# EAGLE board max10adc_v9.0_rack (EAGLE 9.6.2), part 1 of 2
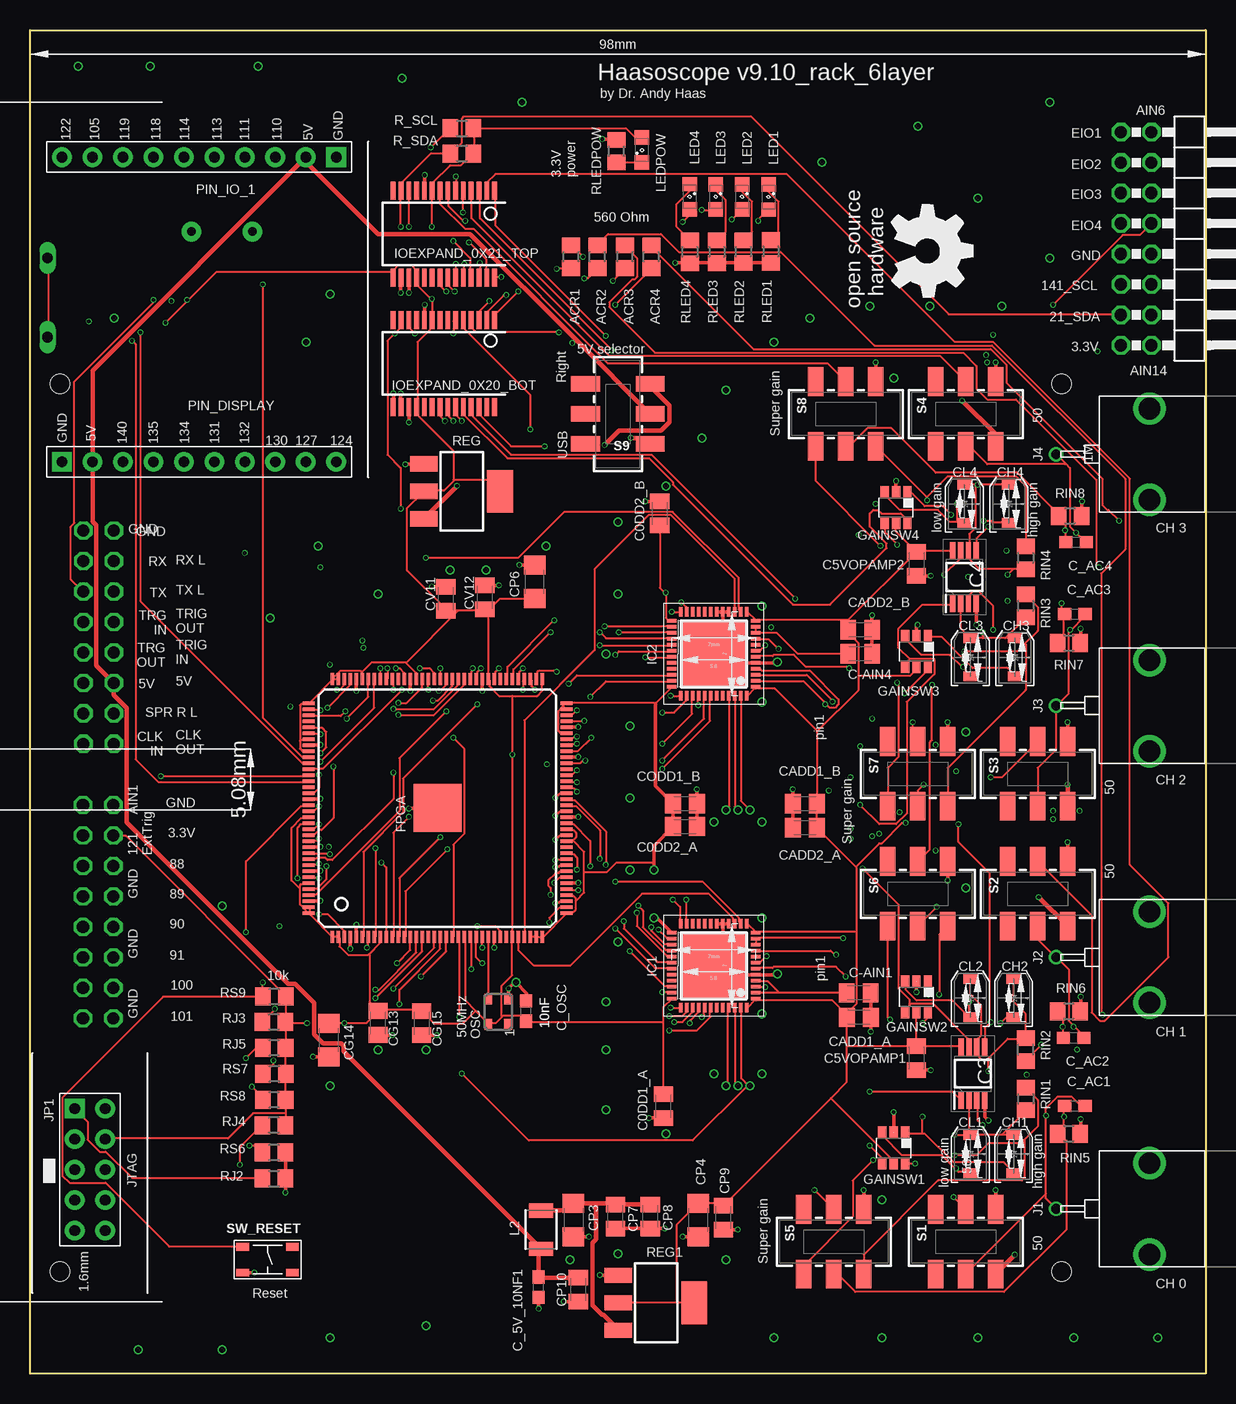
[diagram p3: board, top side]
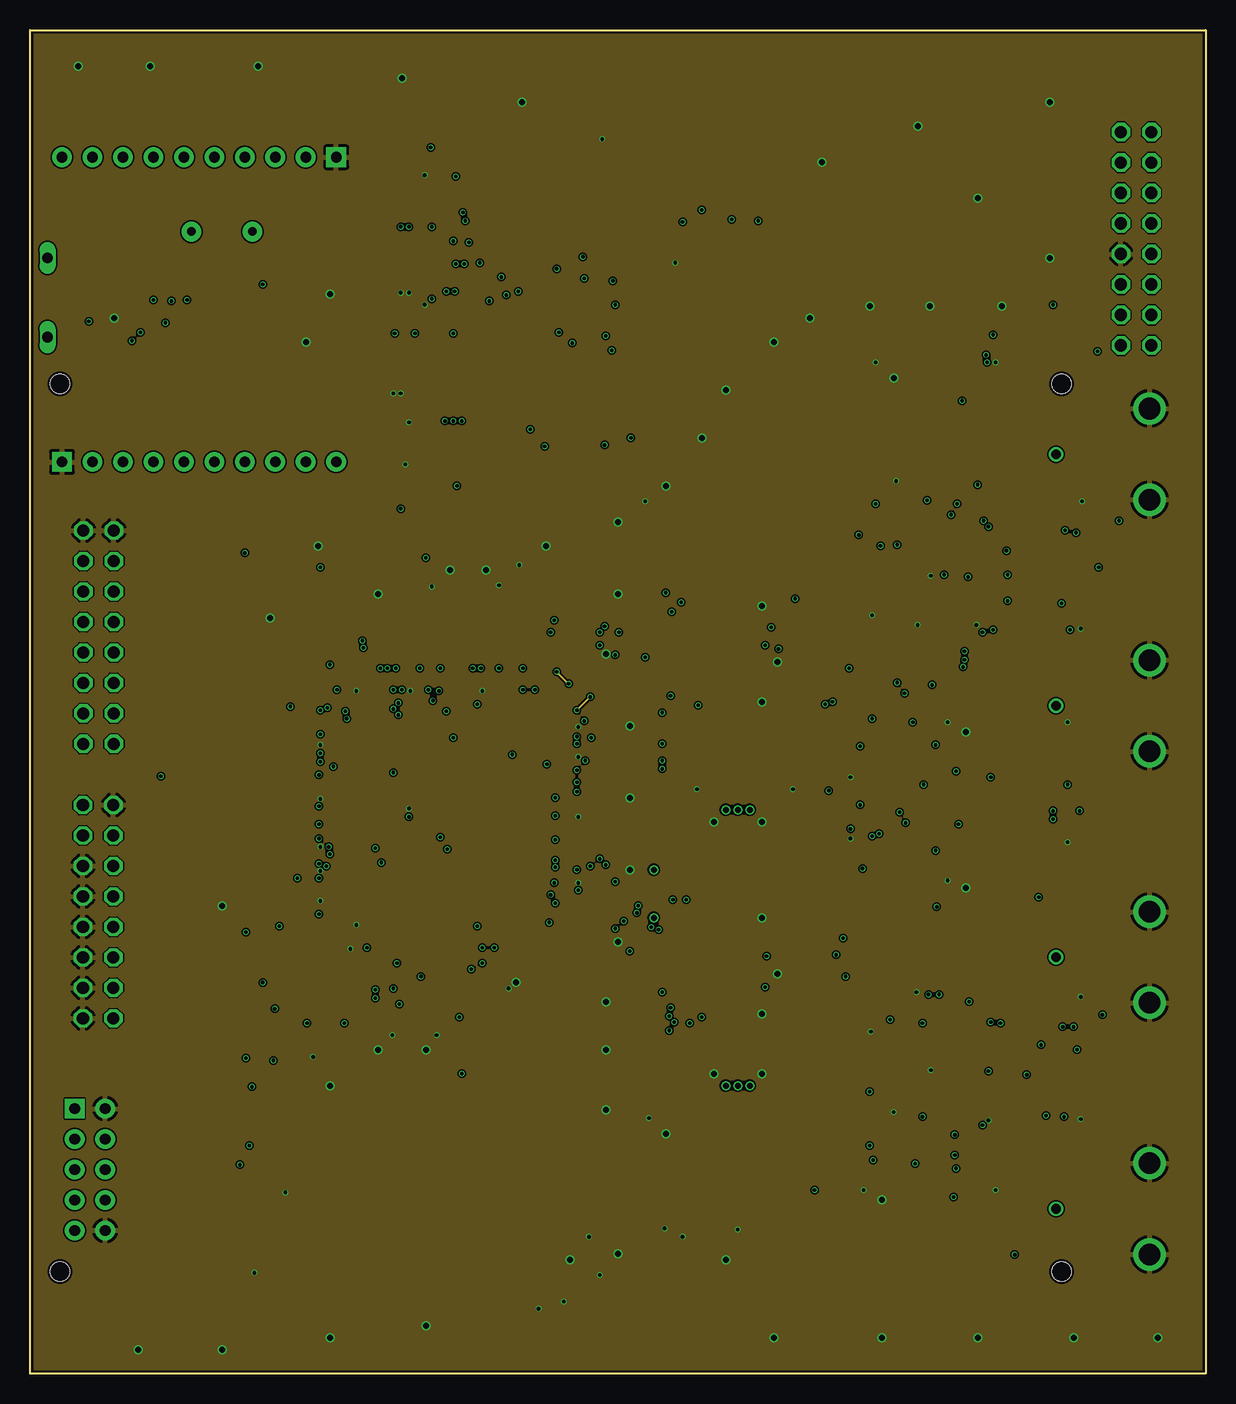
[diagram p4: board, inner layer Route2]
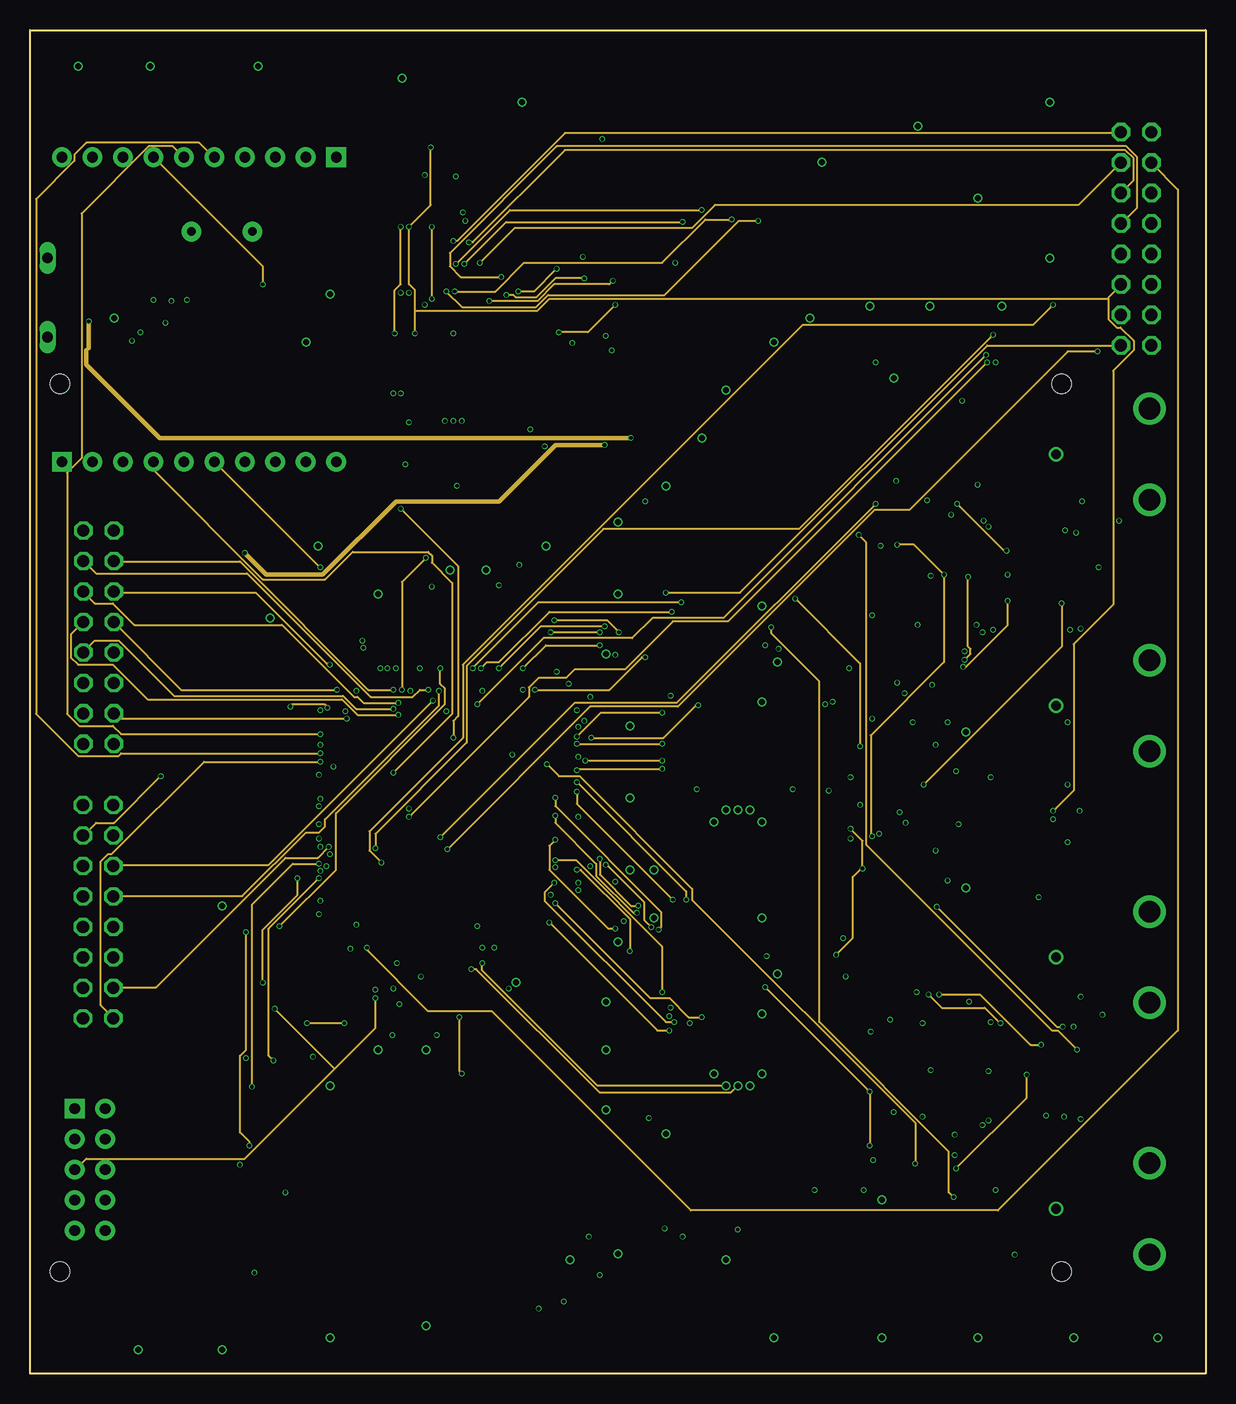
[diagram p5: board, inner layer Route3]
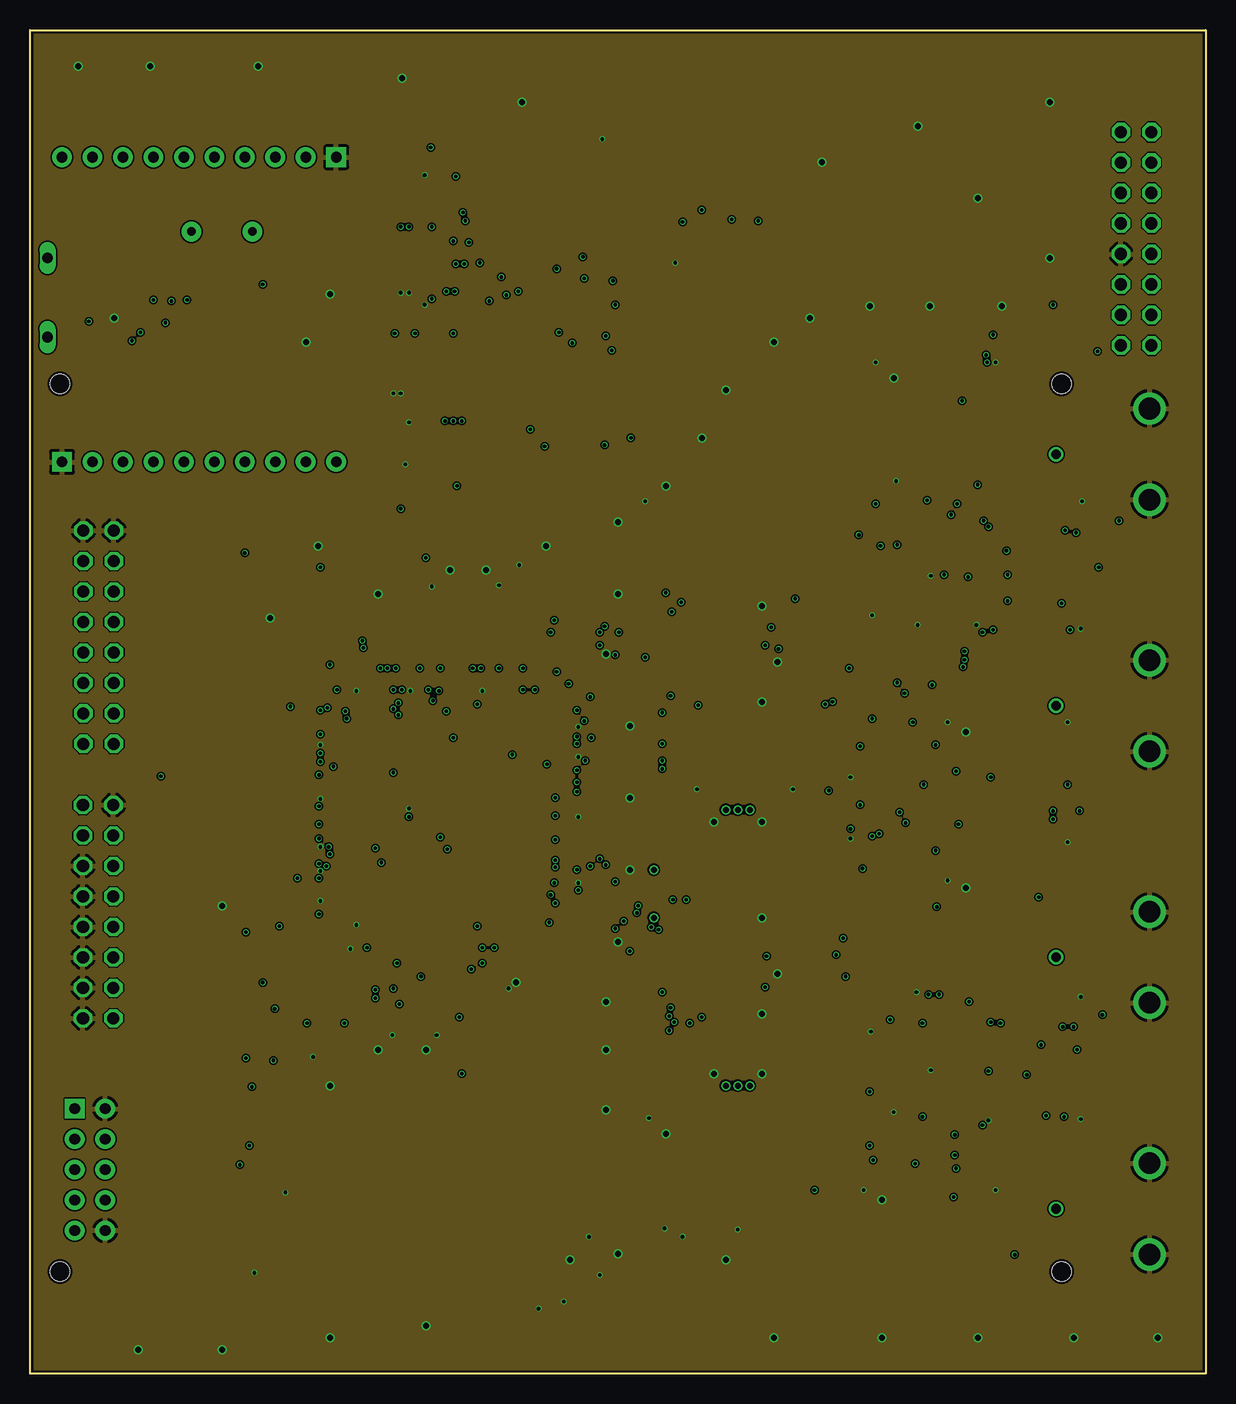
[diagram p6: board, inner layer Route4]
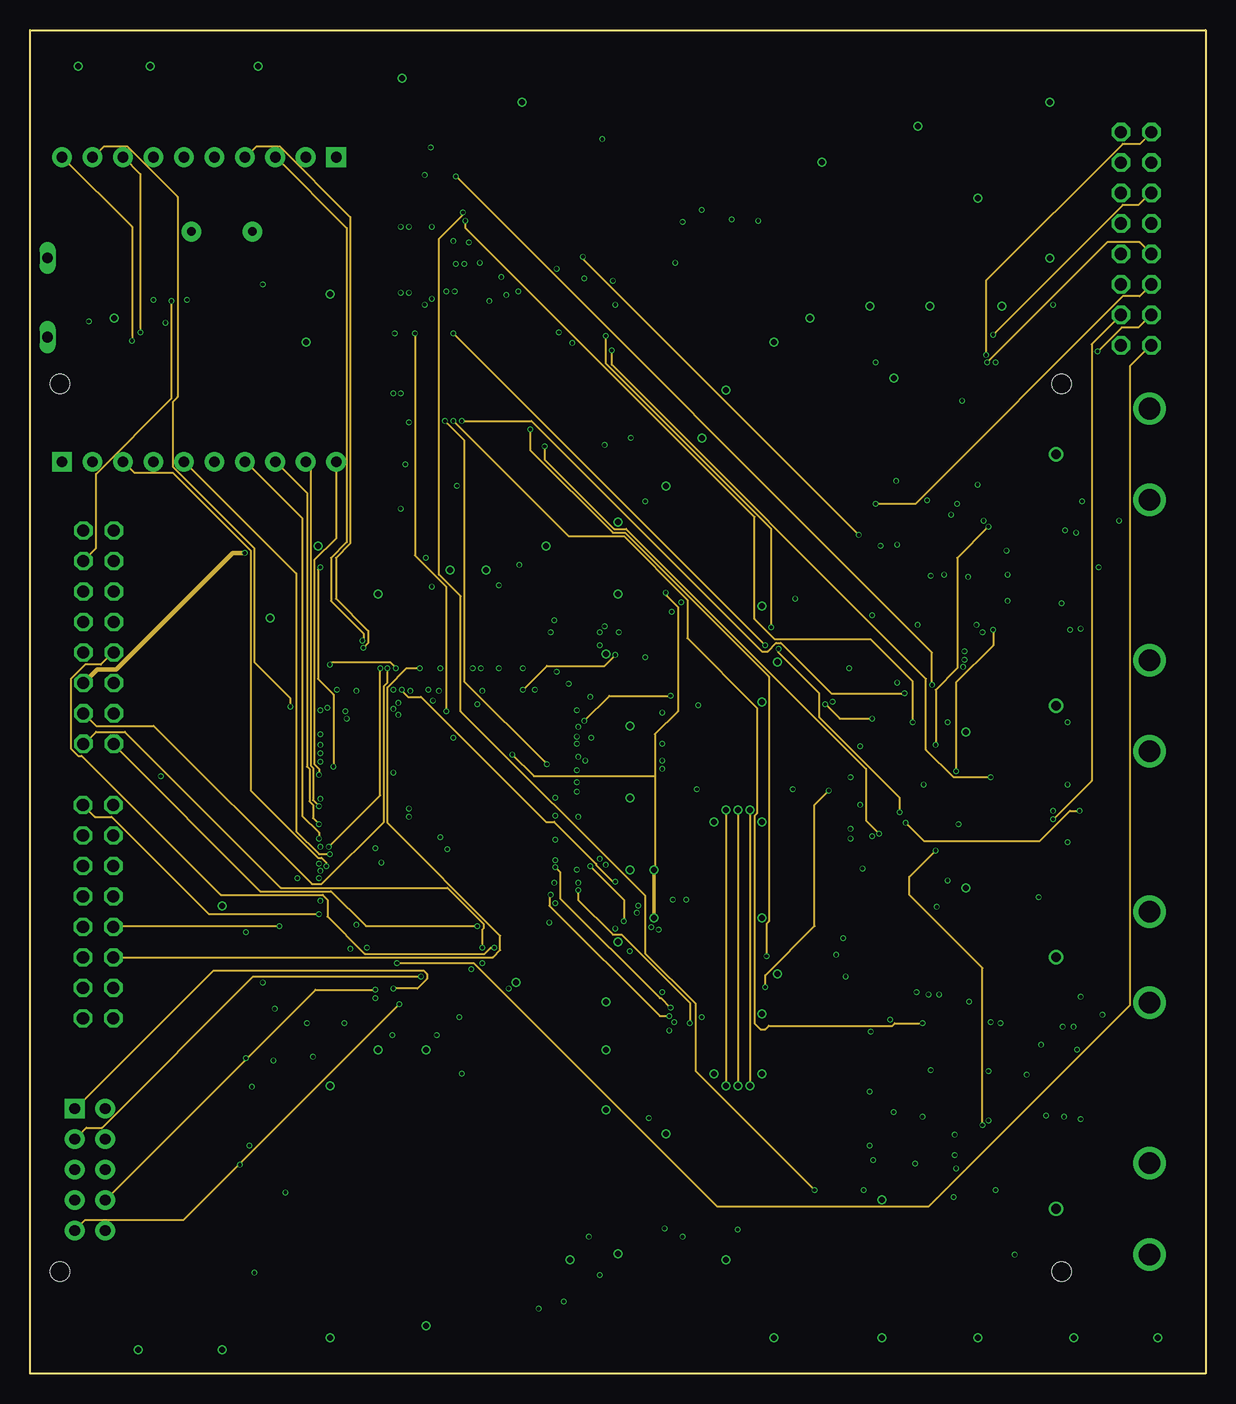
[diagram p7: board, inner layer Route15]
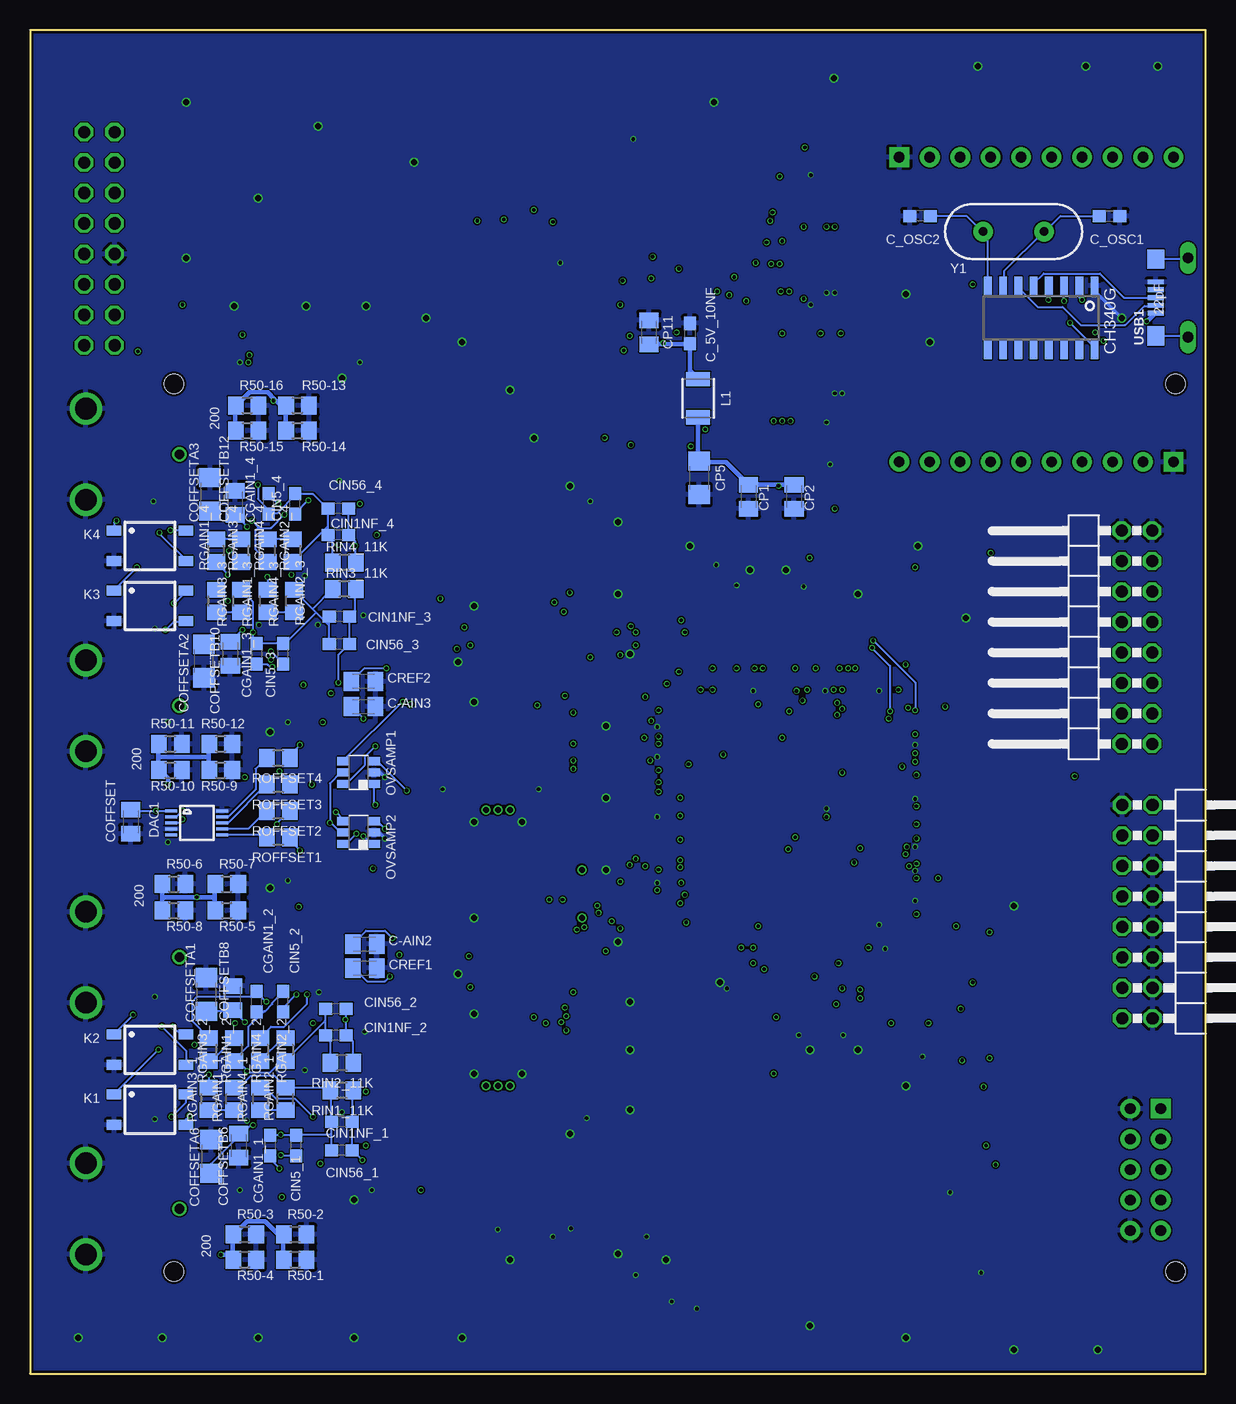
[diagram p8: board, bottom side, seen from below]

Size 98 x 112 mm. Coordinates in mm from the lower left corner, seen from the top.
Outline: 0,0 0,112 98,112 98,0 0,0
Copper layers (1+2*3+4*15+16): Top 0.035559375mm / dielectric 0.6mm / Route2 0.0356mm / dielectric 0.1499mm / Route3 0.0356mm / dielectric 0.2007mm / Route4 0.0356mm / dielectric 0.1499mm / Route15 0.0356mm / dielectric 0.6mm / Bottom 0.035559375mm
Design rules "jlcpcb6layer": minimum track width 5mil, minimum drill 12mil, track to track 5mil, track to pad 5mil, pad to pad 5mil, via to via 5mil, smd to smd 5mil, copper to edge 8mil, drill to drill 6mil, minimum pad ring 5mil, minimum via ring 3mil, stop-mask expansion 2.5mil, vias tented up to drill 0mil, thermal gap 10mil
Net classes: 0 default: width 0.152 mm; 1 gnd: width 0.305 mm; 2 three: width 0.152 mm; 3 five: width 0.381 mm
Holes 1.6 mm at 86,8.5 86,82.5 2.5,82.5 2.5,8.5

## Footprints (pad centres in the part's own frame; a part is rotated, then mirrored left to right if it is on the bottom)
R0805 = smd 1.3 x 1.5: 1 -0.95,0; 2 0.95,0
C0805K = smd 1.3 x 1.6: 1 -1,0; 2 1,0
C0603 = smd 1.1 x 1: 1 -0.85,0; 2 0.85,0
C1206 = smd 1.6 x 1.8: 1 -1.4,0; 2 1.4,0
CTZ3 = smd 1.2 x 0.8: + 0,1.598; - 0,-1.588
MSOP10 = smd 0.25 x 1: 1 -1,-2.113; 2 -0.5,-2.113; 3 0,-2.113; 4 0.5,-2.113; 5 1,-2.113; 6 1,2.113; 7 0.5,2.113; 8 0,2.113; 9 -0.5,2.113; 10 -1,2.113
EQFP144 = smd 1 x 0.3: 1 -10.75,8.75; 2 -10.75,8.25; 3 -10.75,7.75; 4 -10.75,7.25; 5 -10.75,6.75; 6 -10.75,6.25; 7 -10.75,5.75; 8 -10.75,5.25; 9 -10.75,4.75; 10 -10.75,4.25; 11 -10.75,3.75; 12 -10.75,3.25; 13 -10.75,2.75; 14 -10.75,2.25; 15 -10.75,1.75; 16 -10.75,1.25; 17 -10.75,0.75; 18 -10.75,0.25; 19 -10.75,-0.25; 20 -10.75,-0.75; 21 -10.75,-1.25; 22 -10.75,-1.75; 23 -10.75,-2.25; 24 -10.75,-2.75; 25 -10.75,-3.25; 26 -10.75,-3.75; 27 -10.75,-4.25; 28 -10.75,-4.75; 29 -10.75,-5.25; 30 -10.75,-5.75; 31 -10.75,-6.25; 32 -10.75,-6.75; 33 -10.75,-7.25; 34 -10.75,-7.75; 35 -10.75,-8.25; 36 -10.75,-8.75; 73 10.75,-8.75; 74 10.75,-8.25; 75 10.75,-7.75; 76 10.75,-7.25; 77 10.75,-6.75; 78 10.75,-6.25; 79 10.75,-5.75; 80 10.75,-5.25; 81 10.75,-4.75; 82 10.75,-4.25; 83 10.75,-3.75; 84 10.75,-3.25; 85 10.75,-2.75; 86 10.75,-2.25; 87 10.75,-1.75; 88 10.75,-1.25; 89 10.75,-0.75; 90 10.75,-0.25; 91 10.75,0.25; 92 10.75,0.75; 93 10.75,1.25; 94 10.75,1.75; 95 10.75,2.25; 96 10.75,2.75; 97 10.75,3.25; 98 10.75,3.75; 99 10.75,4.25; 100 10.75,4.75; 101 10.75,5.25; 102 10.75,5.75; 103 10.75,6.25; 104 10.75,6.75; 105 10.75,7.25; 106 10.75,7.75; 107 10.75,8.25; 108 10.75,8.75 | smd 0.3 x 1: 37 -8.75,-10.75; 38 -8.25,-10.75; 39 -7.75,-10.75; 40 -7.25,-10.75; 41 -6.75,-10.75; 42 -6.25,-10.75; 43 -5.75,-10.75; 44 -5.25,-10.75; 45 -4.75,-10.75; 46 -4.25,-10.75; 47 -3.75,-10.75; 48 -3.25,-10.75; 49 -2.75,-10.75; 50 -2.25,-10.75; 51 -1.75,-10.75; 52 -1.25,-10.75; 53 -0.75,-10.75; 54 -0.25,-10.75; 55 0.25,-10.75; 56 0.75,-10.75; 57 1.25,-10.75; 58 1.75,-10.75; 59 2.25,-10.75; 60 2.75,-10.75; 61 3.25,-10.75; 62 3.75,-10.75; 63 4.25,-10.75; 64 4.75,-10.75; 65 5.25,-10.75; 66 5.75,-10.75; 67 6.25,-10.75; 68 6.75,-10.75; 69 7.25,-10.75; 70 7.75,-10.75; 71 8.25,-10.75; 72 8.75,-10.75; 109 8.75,10.75; 110 8.25,10.75; 111 7.75,10.75; 112 7.25,10.75; 113 6.75,10.75; 114 6.25,10.75; 115 5.75,10.75; 116 5.25,10.75; 117 4.75,10.75; 118 4.25,10.75; 119 3.75,10.75; 120 3.25,10.75; 121 2.75,10.75; 122 2.25,10.75; 123 1.75,10.75; 124 1.25,10.75; 125 0.75,10.75; 126 0.25,10.75; 127 -0.25,10.75; 128 -0.75,10.75; 129 -1.25,10.75; 130 -1.75,10.75; 131 -2.25,10.75; 132 -2.75,10.75; 133 -3.25,10.75; 134 -3.75,10.75; 135 -4.25,10.75; 136 -4.75,10.75; 137 -5.25,10.75; 138 -5.75,10.75; 139 -6.25,10.75; 140 -6.75,10.75; 141 -7.25,10.75; 142 -7.75,10.75; 143 -8.25,10.75; 144 -8.75,10.75 | smd 4 x 4: E 0,0
DBV_R-PDSO-G6 = smd 0.69 x 0.99: 1 -0.95,-1.29; 2 0,-1.29; 3 0.95,-1.29; 4 0.95,1.3; 5 0,1.3; 6 -0.95,1.3
TQFP-48 = smd 0.8 x 0.3: 1 -3.5,2.75; 2 -3.5,2.25; 3 -3.5,1.75; 4 -3.5,1.25; 5 -3.5,0.75; 6 -3.5,0.25; 7 -3.5,-0.25; 8 -3.5,-0.75; 9 -3.5,-1.25; 10 -3.5,-1.75; 11 -3.5,-2.25; 12 -3.5,-2.75; 25 3.5,-2.75; 26 3.5,-2.25; 27 3.5,-1.75; 28 3.5,-1.25; 29 3.5,-0.75; 30 3.5,-0.25; 31 3.5,0.25; 32 3.5,0.75; 33 3.5,1.25; 34 3.5,1.75; 35 3.5,2.25; 36 3.5,2.75 | smd 0.3 x 0.8: 13 -2.75,-3.5; 14 -2.25,-3.5; 15 -1.75,-3.5; 16 -1.25,-3.5; 17 -0.75,-3.5; 18 -0.25,-3.5; 19 0.25,-3.5; 20 0.75,-3.5; 21 1.25,-3.5; 22 1.75,-3.5; 23 2.25,-3.5; 24 2.75,-3.5; 37 2.75,3.5; 38 2.25,3.5; 39 1.75,3.5; 40 1.25,3.5; 41 0.75,3.5; 42 0.25,3.5; 43 -0.25,3.5; 44 -0.75,3.5; 45 -1.25,3.5; 46 -1.75,3.5; 47 -2.25,3.5; 48 -2.75,3.5 | smd 5.588 x 5.588: EP_GND 0,0
SOP65P490X110-8N = smd 1.425 x 0.45: 1 -2.212,0.975; 2 -2.212,0.325; 3 -2.212,-0.325; 4 -2.212,-0.975; 5 2.212,-0.975; 6 2.212,-0.325; 7 2.212,0.325; 8 2.212,0.975
SSOP28 = smd 0.4 x 1.5: 1 -4.225,-3.625; 2 -3.575,-3.625; 3 -2.925,-3.625; 4 -2.275,-3.625; 5 -1.625,-3.625; 6 -0.975,-3.625; 7 -0.325,-3.625; 8 0.325,-3.625; 9 0.975,-3.625; 10 1.625,-3.625; 11 2.275,-3.625; 12 2.925,-3.625; 13 3.575,-3.625; 14 4.225,-3.625; 15 4.225,3.625; 16 3.575,3.625; 17 2.925,3.625; 18 2.275,3.625; 19 1.625,3.625; 20 0.975,3.625; 21 0.325,3.625; 22 -0.325,3.625; 23 -0.975,3.625; 24 -1.625,3.625; 25 -2.275,3.625; 26 -2.925,3.625; 27 -3.575,3.625; 28 -4.225,3.625
MOLEX-BNC-73100-0105 = drill 1.8: GND1 -3.8,-3.9; GND2 3.8,-3.9 | drill 0.8: SIGNAL 0,3.9
H2X5-2.54 = drill 0.889 pad 1.651 square: 1 -1.27,5.08 | drill 0.889 pad 1.651: 2 -1.27,2.54; 3 -1.27,0; 4 -1.27,-2.54; 5 -1.27,-5.08; 6 1.27,-5.08; 7 1.27,-2.54; 8 1.27,0; 9 1.27,2.54; 10 1.27,5.08
SOP04 = smd 0.8 x 1.2: 1 -1.27,-3; 2 1.27,-3; 3 1.27,3; 4 -1.27,3
1210 = smd 1.2 x 2: 1 -1.6,0; 2 1.6,0
SML0805 = smd 1.2 x 1.2: A 1.05,0; C -1.05,0
ASE = smd 0.9 x 0.65: 1 -1.05,-0.825; 2 1.05,-0.825; 3 1.05,0.825; 4 -1.05,0.825
2X08/90 = drill 1.016 octagon: 1 -8.89,-6.35; 2 -8.89,-3.81; 3 -6.35,-6.35; 4 -6.35,-3.81; 5 -3.81,-6.35; 6 -3.81,-3.81; 7 -1.27,-6.35; 8 -1.27,-3.81; 9 1.27,-6.35; 10 1.27,-3.81; 11 3.81,-6.35; 12 3.81,-3.81; 13 6.35,-6.35; 14 6.35,-3.81; 15 8.89,-6.35; 16 8.89,-3.81
H10-2.54 = drill 0.889 pad 1.651 square: 1 0,11.43 | drill 0.889 pad 1.651: 2 0,8.89; 3 0,6.35; 4 0,3.81; 5 0,1.27; 6 0,-1.27; 7 0,-3.81; 8 0,-6.35; 9 0,-8.89; 10 0,-11.43
SOT-223 = smd 1.27 x 2.286: 1 -2.286,-3.175; 2 0,-3.175; 3 2.286,-3.175 | smd 3.556 x 2.159: TER 0,3.175
JS202011SCQN = smd 1.27 x 2.4: 1 -2.5,-2.7; 2 0,-2.7; 3 2.5,-2.7; 4 -2.5,2.7; 5 0,2.7; 6 2.5,2.7
TACT4.2MM = smd 1.05 x 0.65: P$1 -2.075,1.075; P$2 2.075,1.075; P$3 -2.075,-1.075; P$4 2.075,-1.075
SOIC16 = smd 0.635 x 1.524: 1 -4.445,-2.695; 2 -3.175,-2.695; 3 -1.905,-2.695; 4 -0.635,-2.695; 5 0.635,-2.695; 6 1.905,-2.695; 7 3.175,-2.695; 8 4.445,-2.695; 9 4.445,2.695; 10 3.175,2.695; 11 1.905,2.695; 12 0.635,2.695; 13 -0.635,2.695; 14 -1.905,2.695; 15 -3.175,2.695; 16 -4.445,2.695
10118193-0001LF = smd 0.4 x 1.35: 1 -1.3,2.54; 2 -0.65,2.54; 3 0,2.54; 4 0.65,2.54; 5 1.3,2.54 | drill 0.9 long: S1 -3.3,-0.135; S2 3.3,-0.135 | smd 1.6 x 1.4: S3 -3.2,2.54; S4 3.2,2.54
HC49US = drill 0.7 pad 1.651: 1 -2.54,0; 2 2.54,0

## Placement (x,y rotation side)
ACR1  560  [R0805]  45.1,93.1 90 top
ACR2  560  [R0805]  47.3,93.1 90 top
ACR3  560  [R0805]  49.6,93.1 90 top
ACR4  560  [R0805]  51.8,93.1 90 top
C0DD1_A  0.1uF  [C0805K]  52.8,22.3 270 top
C0DD2_A  0.1uF  [C0805K]  54.6,45.6 0 top
C0DD2_B  0.1uF  [C0805K]  52.5,71.7 90 top
C5VOPAMP1  0.1uF  [C0805K]  73.9,26.3 270 top
C5VOPAMP2  0.1uF  [C0805K]  73.9,67.5 270 top
C-AIN1  0.1uF  [C0805K]  69.08,31.74 0 top
C-AIN2  0.1uF  [C0805K]  70.1,35.8 0 bottom
C-AIN3  0.1uF  [C0805K]  70.2,55.6 0 bottom
C-AIN4  0.1uF  [C0805K]  69.2,60 0 top
C_5V_10NF  0.01uF  [C0603]  43,86.7 270 bottom
C_5V_10NF1  0.01uF  [C0603]  42.4,7.2 90 top
C_AC1  0.01uF  [C0603]  87.1,22.3 0 top
C_AC2  0.01uF  [C0603]  87,28 0 top
C_AC3  0.01uF  [C0603]  87.1,63.3 0 top
C_AC4  0.01uF  [C0603]  87.2,69.3 0 top
C_OSC  0.01uF  [C0603]  41.36,30.22 90 top
C_OSC1  22pF  [C0603]  8,96.5 0 bottom
C_OSC2  22pF  [C0603]  23.8,96.5 180 bottom
CADD1_A  0.1uF  [C0805K]  69.1,29.7 0 top
CADD1_B  0.1uF  [C0805K]  64.6,47.5 180 top
CADD2_A  0.1uF  [C0805K]  64.6,45.5 180 top
CADD2_B  0.1uF  [C0805K]  69.2,62 0 top
CG13  1uF  [C0805K]  29.01,29.23 270 top
CG14  10uF  [C1206]  24.91,27.79 270 top
CG15  0.1uF  [C0805K]  32.65,29.21 270 top
CGAIN1_1  33pF  [C0603]  78,19 270 bottom
CGAIN1_2  33pF  [C0603]  79.1,31 90 bottom
CGAIN1_3  33pF  [C0603]  79.1,60 270 bottom
CGAIN1_4  33pF  [C0603]  78.1,72.5 90 bottom
CH1  3-10pF  [CTZ3]  82,18.3 0 top
CH2  3-10pF  [CTZ3]  82,31.3 0 top
CH3  3-10pF  [CTZ3]  82.1,59.7 0 top
CH4  3-10pF  [CTZ3]  81.6,72.5 0 top
CIN1NF_1  1nF  [C0603]  72,21 180 bottom
CIN1NF_2  1nF  [C0603]  72.5,28.2 180 bottom
CIN1NF_3  1nF  [C0603]  72.2,63.1 180 bottom
CIN1NF_4  1nF  [C0603]  72.3,69.9 180 bottom
CIN5_1  10pF  [C0603]  75.8,19 90 bottom
CIN5_2  10pF  [C0603]  76.9,31 90 bottom
CIN5_3  10pF  [C0603]  76.9,60 90 bottom
CIN5_4  10pF  [C0603]  75.9,72.5 90 bottom
CIN56_1  56pF  [C0603]  72,18.6 180 bottom
CIN56_2  56pF  [C0603]  72.5,30.4 180 bottom
CIN56_3  56pF  [C0603]  72.2,60.8 180 bottom
CIN56_4  56pF  [C0603]  72.3,72.1 180 bottom
CL1  8-45pF  [CTZ3]  78.4,18.3 0 top
CL2  8-45pF  [CTZ3]  78.4,31.3 0 top
CL3  8-45pF  [CTZ3]  78.4,59.7 0 top
CL4  8-45pF  [CTZ3]  77.9,72.5 0 top
CODD1_B  0.1uF  [C0805K]  54.6,47.5 0 top
COFFSET  0.1uF  [C0805K]  89.6,46 90 bottom
COFFSETA1  10uF  [C1206]  83.3,31.6 270 bottom
COFFSETA2  10uF  [C1206]  83.5,59.4 90 bottom
COFFSETA3  10uF  [C1206]  83,73.3 270 bottom
COFFSETA6  10uF  [C1206]  82.9,18.1 270 bottom
COFFSETB6  0.1uF  [C0805K]  80.6,19 90 bottom
COFFSETB8  0.1uF  [C0805K]  81.1,31.3 270 bottom
COFFSETB10  0.1uF  [C0805K]  81.3,60 90 bottom
COFFSETB12  0.1uF  [C0805K]  80.9,72.6 270 bottom
CP1  1uF  [C0805K]  38.1,73.1 270 bottom
CP2  0.1uF  [C0805K]  34.3,73.1 270 bottom
CP3  10uF  [C1206]  45.3,12.8 270 top
CP4  10uF  [C1206]  55.7,12.8 270 top
CP5  10uF  [C1206]  42.22,74.67 270 bottom
CP6  10uF  [C1206]  42.08,66 90 top
CP7  1uF  [C0805K]  48.8,13.1 270 top
CP8  0.1uF  [C0805K]  51.7,13.1 270 top
CP9  1uF  [C0805K]  57.8,13 270 top
CP10  1uF  [C0805K]  45.7,7 90 top
CP11  1uF  [C0805K]  46.4,86.8 270 bottom
CREF1  0.1uF  [C0805K]  70.08,33.8 0 bottom
CREF2  0.1uF  [C0805K]  70.2,57.7 0 bottom
CV11  0.1uF  [C0805K]  34.67,64.59 90 top
CV12  1uF  [C0805K]  37.91,64.71 90 top
DAC1  MCP4728  [MSOP10]  84.1,45.9 270 bottom
FPGA  10M08SAE144  [EQFP144]  33.96,47.13 90 top
GAINSW1  741G3157DBVR  [DBV_R-PDSO-G6]  72,18.8 180 top
GAINSW2  741G3157DBVR  [DBV_R-PDSO-G6]  73.9,31.4 180 top
GAINSW3  741G3157DBVR  [DBV_R-PDSO-G6]  73.9,60.2 180 top
GAINSW4  741G3157DBVR  [DBV_R-PDSO-G6]  72.2,72.2 180 top
GOLD_ORB_SM1  OSHWLOGOLOGO8MM  [OSHW_8MM]  74.8,93.6 270 top
IC1  MAX19506  [TQFP-48]  57,34 180 top
IC2  MAX19506  [TQFP-48]  57,60 180 top
IC3  MAX4416EUA+  [SOP65P490X110-8N]  78.6,25 90 top
IC4  MAX4416EUA+  [SOP65P490X110-8N]  77.9,66.4 90 top
IOEXPAND_0X20_BOT  MCP23017SS  [SSOP28]  34.5,84.2 180 top
IOEXPAND_0X21_TOP  MCP23017SS  [SSOP28]  34.5,95 180 top
J1  MOLEX_BNC_73100-0105  [MOLEX-BNC-73100-0105]  89.44,13.73 90 top
J2  MOLEX_BNC_73100-0105  [MOLEX-BNC-73100-0105]  89.44,34.7 90 top
J3  MOLEX_BNC_73100-0105  [MOLEX-BNC-73100-0105]  89.44,55.67 90 top
J4  MOLEX_BNC_73100-0105  [MOLEX-BNC-73100-0105]  89.44,76.64 90 top
JP1  2x5p-2.54  [H2X5-2.54]  5,17 0 top
K1  AQY21SOP  [SOP04]  88,22 270 bottom
K2  AQY21SOP  [SOP04]  88,27 270 bottom
K3  AQY21SOP  [SOP04]  88,64 270 bottom
K4  AQY21SOP  [SOP04]  88,69 270 bottom
L1  10uH  [1210]  42.3,81.3 270 bottom
L2  10uH  [1210]  42.6,12 90 top
LED1  MF-LED-0805-RED  [SML0805]  61.58,98.07 270 top
LED2  MF-LED-0805-RED  [SML0805]  59.38,98.08 270 top
LED3  MF-LED-0805-RED  [SML0805]  57.18,98.09 270 top
LED4  MF-LED-0805-RED  [SML0805]  55,98.1 270 top
LEDPOW  MF-LED-0805-RED  [SML0805]  51,102 90 top
OSC  ASE-50.000MHZ-ET  [ASE]  39.04,30.16 90 top
OVSAMP1  741G3157DBVR  [DBV_R-PDSO-G6]  70.6,50.1 90 bottom
OVSAMP2  741G3157DBVR  [DBV_R-PDSO-G6]  70.6,45.1 90 bottom
PIN_AIN_IO2_PWRGND  15-91-2160  [2X08/90]  0.6,38.5 270 bottom
PIN_ANALOG_IOEXP  15-91-2160  [2X08/90]  97.3,94.6 270 top
PIN_ANALOG_IOEXP1  15-91-2160  [2X08/90]  10.8,61.38 90 bottom
PIN_DISPLAY  YELLOW-10P-2.54  [H10-2.54]  14.1,76 90 top
PIN_IO_1  YELLOW-10P-2.54  [H10-2.54]  14.1,101.4 270 top
R50-1  200R  [R0805]  75.9,9.5 0 bottom
R50-2  200R  [R0805]  75.9,11.6 0 bottom
R50-3  200R  [R0805]  80.1,11.6 0 bottom
R50-4  200R  [R0805]  80.1,9.5 0 bottom
R50-5  200R  [R0805]  81.6,38.6 0 bottom
R50-6  200R  [R0805]  86,40.8 0 bottom
R50-7  200R  [R0805]  81.6,40.8 0 bottom
R50-8  200R  [R0805]  86,38.6 0 bottom
R50-9  200R  [R0805]  82.1,50.3 0 bottom
R50-10  200R  [R0805]  86.3,50.3 0 bottom
R50-11  200R  [R0805]  86.3,52.5 0 bottom
R50-12  200R  [R0805]  82.1,52.5 0 bottom
R50-13  200R  [R0805]  75.7,80.7 0 bottom
R50-14  200R  [R0805]  75.7,78.6 0 bottom
R50-15  200R  [R0805]  79.9,78.6 0 bottom
R50-16  200R  [R0805]  79.9,80.7 0 bottom
R_SCL  10K  [R0805]  36,103.8 0 top
R_SDA  10K  [R0805]  36,101.7 0 top
REG  LDL1117S33R  [SOT-223]  36.01,73.54 270 top
REG1  LDL1117S33R  [SOT-223]  52.2,5.9 270 top
RGAIN1_1  100k  [R0805]  81,22.9 90 bottom
RGAIN1_2  100k  [R0805]  81,27 270 bottom
RGAIN1_3  100k  [R0805]  80.4,64.4 90 bottom
RGAIN1_4  100k  [R0805]  82.5,68.6 270 bottom
RGAIN2_1  1M  [R0805]  76.7,22.9 90 bottom
RGAIN2_2  1M  [R0805]  76.7,27 270 bottom
RGAIN2_3  1M  [R0805]  76,64.4 90 bottom
RGAIN2_4  1M  [R0805]  76.1,68.6 270 bottom
RGAIN3_1  100k  [R0805]  83.1,22.9 270 bottom
RGAIN3_2  100k  [R0805]  83.1,27 270 bottom
RGAIN3_3  100k  [R0805]  82.5,64.4 270 bottom
RGAIN3_4  100k  [R0805]  80.4,68.6 90 bottom
RGAIN4_1  1M  [R0805]  78.8,22.9 270 bottom
RGAIN4_2  1M  [R0805]  78.8,27 270 bottom
RGAIN4_3  1M  [R0805]  78.2,64.4 270 bottom
RGAIN4_4  1M  [R0805]  78.2,68.6 90 bottom
RIN1  1.1M  [R0805]  83,22.9 270 top
RIN1_11K  11K  [R0805]  72,23.6 180 bottom
RIN2  1.1M  [R0805]  83,27 90 top
RIN2_11K  11K  [R0805]  72,25.9 180 bottom
RIN3  1.1M  [R0805]  83,64 270 top
RIN3_11K  11K  [R0805]  71.8,65.4 180 bottom
RIN4  1.1M  [R0805]  83,68 270 top
RIN4_11K  11K  [R0805]  71.8,67.6 180 bottom
RIN5  10M  [R0805]  86.6,20 0 top
RIN6  10M  [R0805]  86.6,30.2 0 top
RIN7  10M  [R0805]  86.6,60.9 0 top
RIN8  10M  [R0805]  86.7,71.5 0 top
RJ2  10K  [R0805]  20.33,16.26 0 top
RJ3  10K  [R0805]  20.34,29.3 180 top
RJ4  10K  [R0805]  20.33,20.7 180 top
RJ5  10K  [R0805]  20.36,27.14 180 top
RLED1  560  [R0805]  61.76,93.53 270 top
RLED2  560  [R0805]  59.46,93.52 270 top
RLED3  560  [R0805]  57.26,93.51 270 top
RLED4  560  [R0805]  55,93.5 270 top
RLEDPOW  560  [R0805]  48.9,101.9 90 top
ROFFSET1  200  [R0805]  77.3,44.7 180 bottom
ROFFSET2  200R  [R0805]  77.3,46.9 180 bottom
ROFFSET3  200R  [R0805]  77.3,49.1 180 bottom
ROFFSET4  200R  [R0805]  77.3,51.3 180 bottom
RS6  10K  [R0805]  20.34,18.42 180 top
RS7  10K  [R0805]  20.37,24.98 180 top
RS8  10K  [R0805]  20.36,22.82 180 top
RS9  10K  [R0805]  20.37,31.42 180 top
S1  JS202011SCQN  [JS202011SCQN]  78,11 0 top
S2  JS202011SCQN  [JS202011SCQN]  84,40 0 top
S3  JS202011SCQN  [JS202011SCQN]  84,50 0 top
S4  JS202011SCQN  [JS202011SCQN]  78,80 0 top
S5  JS202011SCQN  [JS202011SCQN]  67,11 0 top
S6  JS202011SCQN  [JS202011SCQN]  74,40 0 top
S7  JS202011SCQN  [JS202011SCQN]  74,50 0 top
S8  JS202011SCQN  [JS202011SCQN]  68,80 0 top
S9  JS202011SCQN  [JS202011SCQN]  49,80 90 top
SW_RESET  MF-SW-TACT-4.2MM  [TACT4.2MM]  19.8,9.5 180 top
U340G  CH340G  [SOIC16]  13.7,88 180 bottom
USB1  MF-CON-MICROUSB-RIGHT  [10118193-0001LF]  1.6,89.7 90 bottom
Y1  ABL-12.000MHZ-B2  [HC49US]  16,95.2 180 bottom